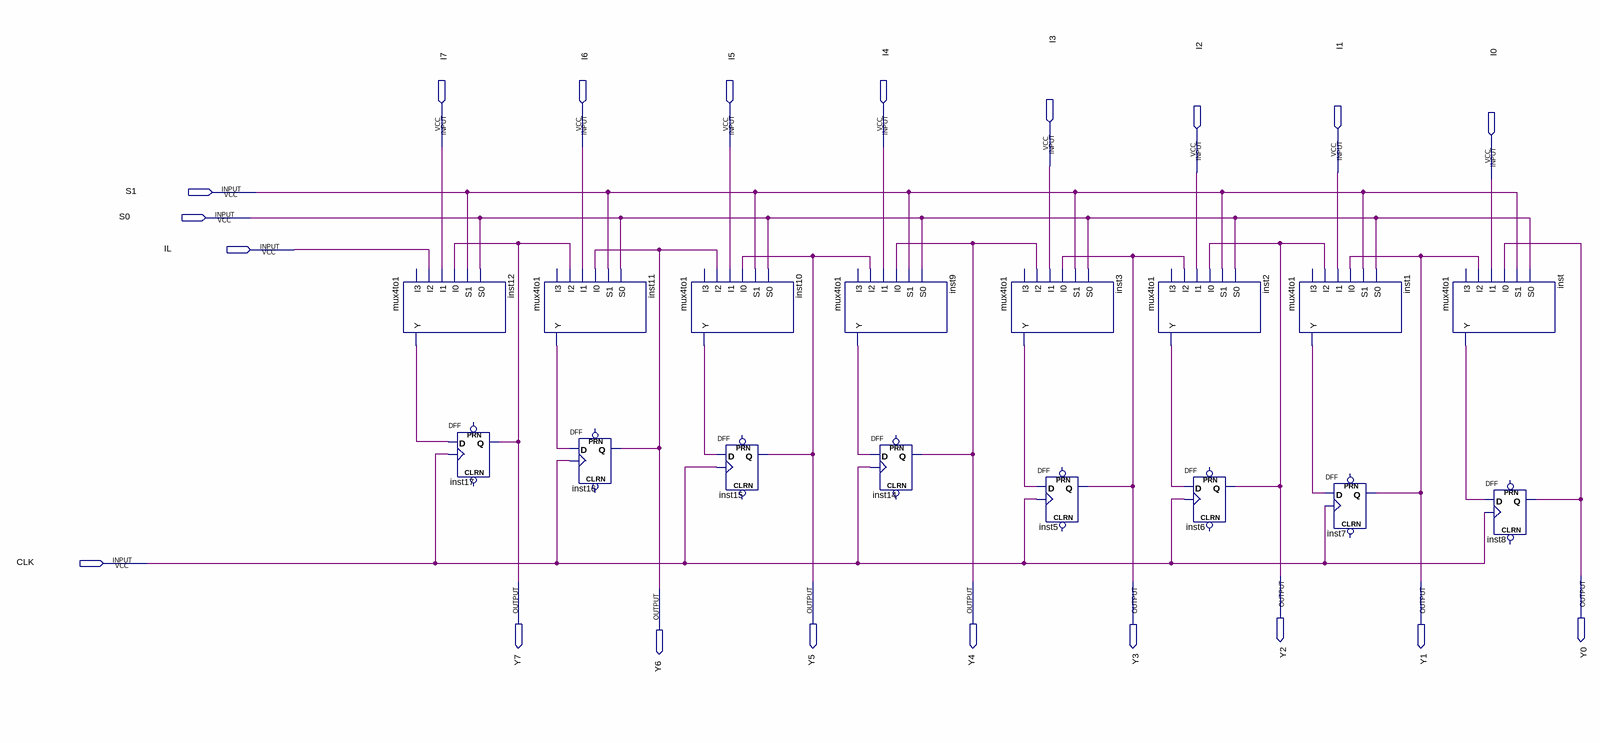
[diagram p0: schematic sheet]
// Quartus schematic multiplicant.bdf as structural Verilog: 16 symbols, 20 pins
module multiplicant (
  input  I7,
  input  I6,
  input  I5,
  input  I4,
  input  I3,
  input  I2,
  input  I1,
  input  I0,
  input  S1,
  input  S0,
  input  IL,
  input  CLK,
  output Y2,
  output Y0,
  output Y7,
  output Y5,
  output Y4,
  output Y3,
  output Y1,
  output Y6
);

  wire inst1_y, inst2_y, inst3_y, inst9_y, inst10_y, inst11_y, inst12_y, inst_y;

  mux4to1 inst12 (.I2(IL), .I1(I7), .I0(Y7), .S1(S1), .S0(S0), .Y(inst12_y));  // open: I3
  DFF inst17 (.CLK(CLK), .D(inst12_y), .Q(Y7));  // open: CLRN, PRN
  mux4to1 inst11 (.I2(Y7), .I1(I6), .I0(Y6), .S1(S1), .S0(S0), .Y(inst11_y));  // open: I3
  DFF inst16 (.CLK(CLK), .D(inst11_y), .Q(Y6));  // open: CLRN, PRN
  mux4to1 inst10 (.I2(Y6), .I1(I5), .I0(Y5), .S1(S1), .S0(S0), .Y(inst10_y));  // open: I3
  DFF inst15 (.CLK(CLK), .D(inst10_y), .Q(Y5));  // open: CLRN, PRN
  mux4to1 inst9 (.I2(Y5), .I1(I4), .I0(Y4), .S1(S1), .S0(S0), .Y(inst9_y));  // open: I3
  DFF inst14 (.CLK(CLK), .D(inst9_y), .Q(Y4));  // open: CLRN, PRN
  mux4to1 inst3 (.I2(Y4), .I1(I3), .I0(Y3), .S1(S1), .S0(S0), .Y(inst3_y));  // open: I3
  DFF inst5 (.CLK(CLK), .D(inst3_y), .Q(Y3));  // open: CLRN, PRN
  mux4to1 inst2 (.I2(Y3), .I1(I2), .I0(Y2), .S1(S1), .S0(S0), .Y(inst2_y));  // open: I3
  DFF inst6 (.CLK(CLK), .D(inst2_y), .Q(Y2));  // open: CLRN, PRN
  mux4to1 inst1 (.I2(Y2), .I1(I1), .I0(Y1), .S1(S1), .S0(S0), .Y(inst1_y));  // open: I3
  DFF inst7 (.CLK(CLK), .D(inst1_y), .Q(Y1));  // open: CLRN, PRN
  mux4to1 inst (.I2(Y1), .I1(I0), .I0(Y0), .S1(S1), .S0(S0), .Y(inst_y));  // open: I3
  DFF inst8 (.CLK(CLK), .D(inst_y), .Q(Y0));  // open: CLRN, PRN
endmodule
